# Altium project MainBoard.PrjPcb
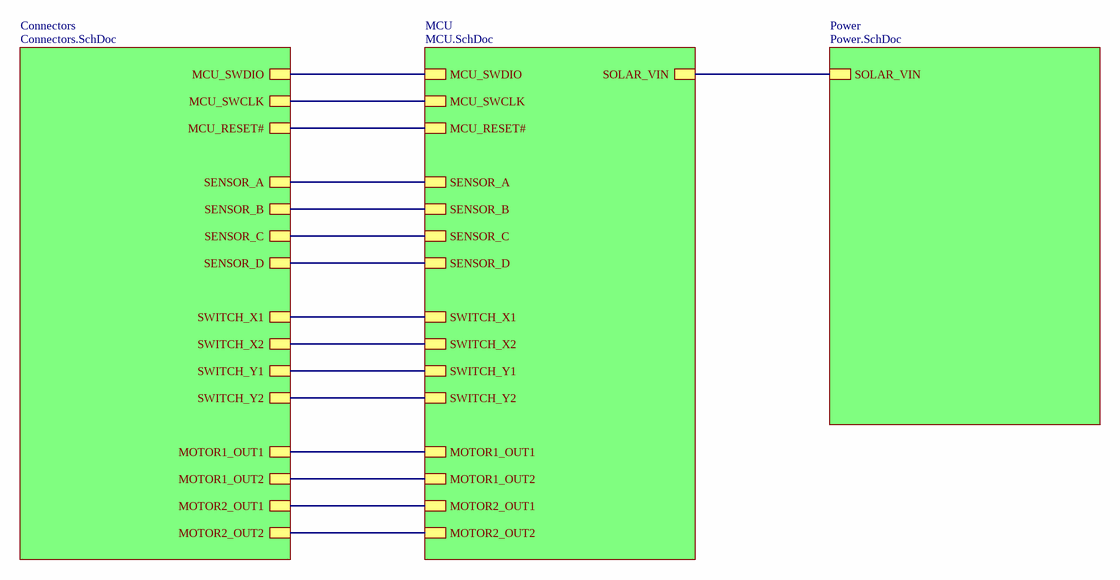
[diagram p0: Main.SchDoc]
ProjectAuthor: NeoProg; ProjectRevision: 1.00; ProjectStatus: D
4 sheets, 74 parts. Net scope: hierarchical (ports join the sheet entries above them; power ports are global).
Board file: PCB.PcbDoc
Sheets:
  Main.SchDoc
    Connectors = Connectors.SchDoc
    MCU = MCU.SchDoc
    Power = Power.SchDoc

## Sheet Main.SchDoc
size A3; SheetNumber: 1; SheetTotal: 1

### Sub-sheets
Connectors = Connectors.SchDoc: MCU_SWDIO, MCU_SWCLK, MCU_RESET#, SENSOR_A, SENSOR_B, SENSOR_C, SENSOR_D, SWITCH_X1, SWITCH_X2, SWITCH_Y1, SWITCH_Y2, MOTOR1_OUT1, MOTOR1_OUT2, MOTOR2_OUT1, MOTOR2_OUT2
MCU = MCU.SchDoc: MCU_SWDIO, MCU_SWCLK, MCU_RESET#, SOLAR_VIN, SENSOR_A, SENSOR_B, SENSOR_C, SENSOR_D, SWITCH_X1, SWITCH_X2, SWITCH_Y1, SWITCH_Y2, MOTOR1_OUT1, MOTOR1_OUT2, MOTOR2_OUT1, MOTOR2_OUT2
Power = Power.SchDoc: SOLAR_VIN

### Nets
MCU_RESET#: sheet Connectors/MCU_RESET#, sheet MCU/MCU_RESET#
MCU_SWCLK: sheet Connectors/MCU_SWCLK, sheet MCU/MCU_SWCLK
MCU_SWDIO: sheet Connectors/MCU_SWDIO, sheet MCU/MCU_SWDIO
MOTOR1_OUT1: sheet Connectors/MOTOR1_OUT1, sheet MCU/MOTOR1_OUT1
MOTOR1_OUT2: sheet Connectors/MOTOR1_OUT2, sheet MCU/MOTOR1_OUT2
MOTOR2_OUT1: sheet Connectors/MOTOR2_OUT1, sheet MCU/MOTOR2_OUT1
MOTOR2_OUT2: sheet Connectors/MOTOR2_OUT2, sheet MCU/MOTOR2_OUT2
SENSOR_A: sheet Connectors/SENSOR_A, sheet MCU/SENSOR_A
SENSOR_B: sheet Connectors/SENSOR_B, sheet MCU/SENSOR_B
SENSOR_C: sheet Connectors/SENSOR_C, sheet MCU/SENSOR_C
SENSOR_D: sheet Connectors/SENSOR_D, sheet MCU/SENSOR_D
SOLAR_VIN: sheet MCU/SOLAR_VIN, sheet Power/SOLAR_VIN
SWITCH_X1: sheet Connectors/SWITCH_X1, sheet MCU/SWITCH_X1
SWITCH_X2: sheet Connectors/SWITCH_X2, sheet MCU/SWITCH_X2
SWITCH_Y1: sheet Connectors/SWITCH_Y1, sheet MCU/SWITCH_Y1
SWITCH_Y2: sheet Connectors/SWITCH_Y2, sheet MCU/SWITCH_Y2

## Sheet Connectors.SchDoc
size A4; SheetNumber: 1; SheetTotal: 1
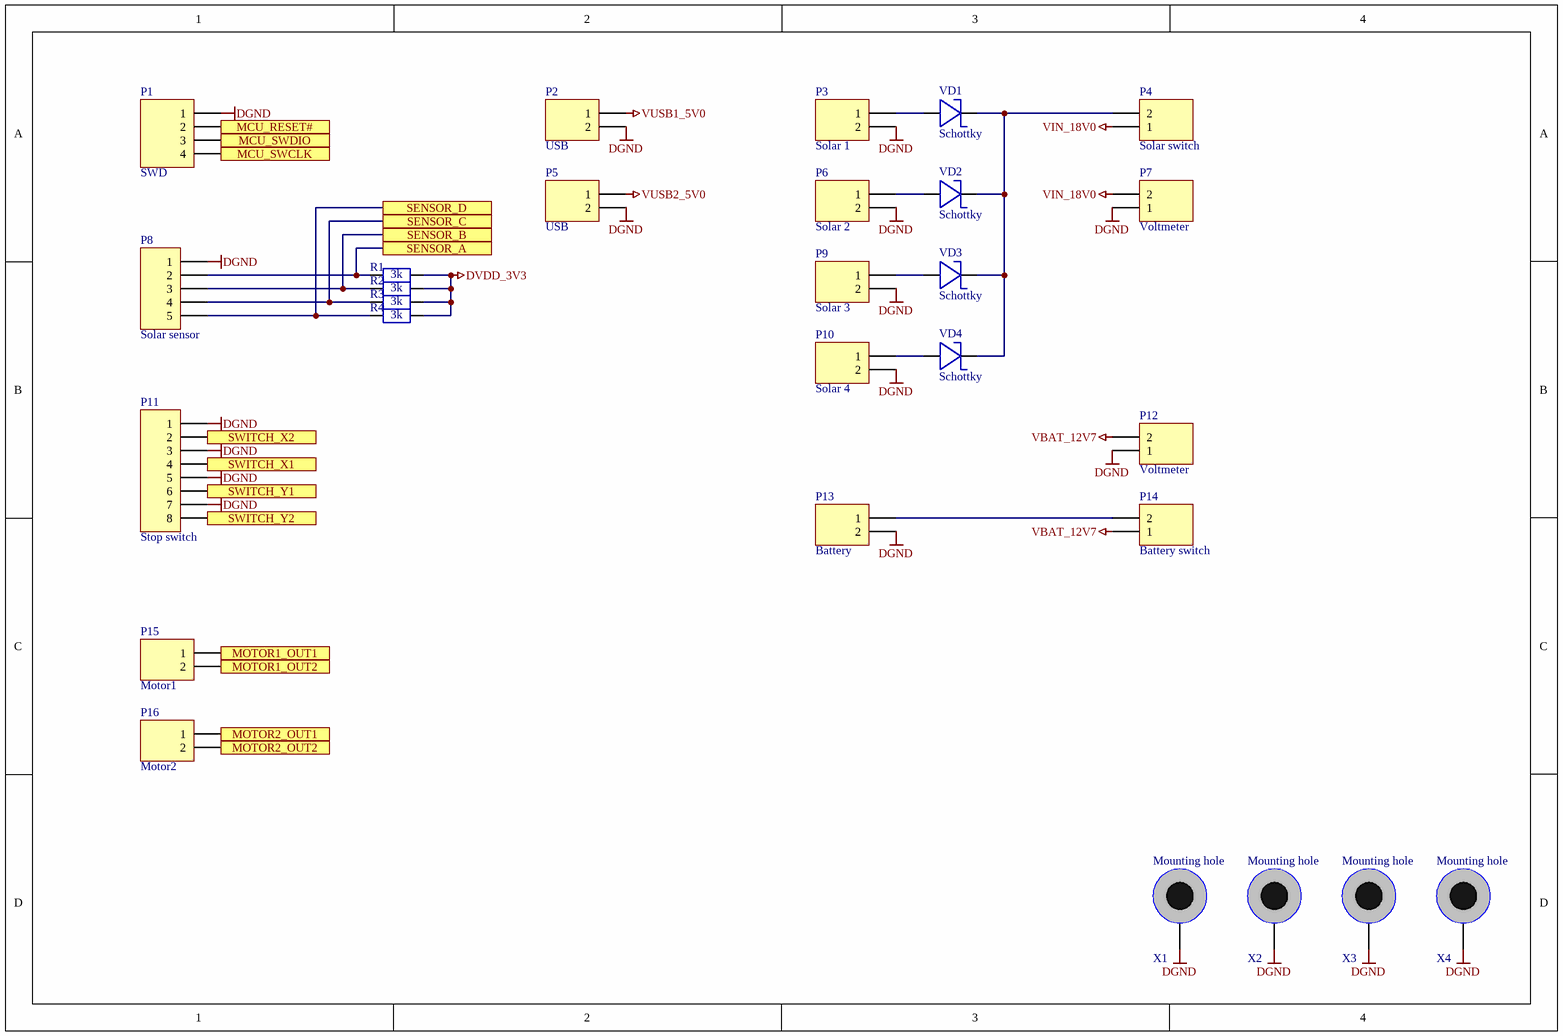
[diagram p1: Connectors.SchDoc]

### Parts
P1  SWD  [PLS-4 2.54]
P2  USB  [CWF-2]
P3  Solar 1  [CWF-2]
P4  Solar switch  [CWF-2]
P5  USB  [CWF-2]
P6  Solar 2  [CWF-2]
P7  Voltmeter  [CWF-2]
P8  Solar sensor  [HDR1X5]
P9  Solar 3  [CWF-2]
P10  Solar 4  [CWF-2]
P11  Stop switch  [HDR1X8]
P12  Voltmeter  [CWF-2]
P13  Battery  [CWF-2]
P14  Battery switch  [CWF-2]
P15  Motor1  [CWF-2]
P16  Motor2  [CWF-2]
R1  3k  [R_0603/1608]
R2  3k  [R_0603/1608]
R3  3k  [R_0603/1608]
R4  3k  [R_0603/1608]
VD1  Schottky  [DO214AC/SMA]
VD2  Schottky  [DO214AC/SMA]
VD3  Schottky  [DO214AC/SMA]
VD4  Schottky  [DO214AC/SMA]
X1  Mounting hole  [HOLE_M3_D6.0/3.5]  (no BOM)
X2  Mounting hole  [HOLE_M3_D6.0/3.5]  (no BOM)
X3  Mounting hole  [HOLE_M3_D6.0/3.5]  (no BOM)
X4  Mounting hole  [HOLE_M3_D6.0/3.5]  (no BOM)

### Ports
MCU_RESET#, MCU_SWCLK, MCU_SWDIO, MOTOR1_OUT1, MOTOR1_OUT2, MOTOR2_OUT1, MOTOR2_OUT2, SENSOR_A, SENSOR_B, SENSOR_C, SENSOR_D, SWITCH_X1, SWITCH_X2, SWITCH_Y1, SWITCH_Y2

### Nets
DGND: P1.1 P2.2 P3.2 P5.2 P6.2 P7.1 P8.1 P9.2 P10.2 P11.1 P11.3 P11.5 P11.7 P12.1 P13.2 X1.1 X2.1 X3.1 X4.1
DVDD_3V3: R1.1 R2.1 R3.1 R4.1
VBAT_12V7: P12.2 P14.1
VIN_18V0: P4.1 P7.2
VUSB1_5V0: P2.1
VUSB2_5V0: P5.1
MCU_RESET#: P1.2 ; port MCU_RESET#
MCU_SWCLK: P1.4 ; port MCU_SWCLK
MCU_SWDIO: P1.3 ; port MCU_SWDIO
MOTOR1_OUT1: P15.1 ; port MOTOR1_OUT1
MOTOR1_OUT2: P15.2 ; port MOTOR1_OUT2
MOTOR2_OUT1: P16.1 ; port MOTOR2_OUT1
MOTOR2_OUT2: P16.2 ; port MOTOR2_OUT2
SENSOR_A: P8.2 R1.2 ; port SENSOR_A
SENSOR_B: P8.3 R2.2 ; port SENSOR_B
SENSOR_C: P8.4 R3.2 ; port SENSOR_C
SENSOR_D: P8.5 R4.2 ; port SENSOR_D
SWITCH_X1: P11.4 ; port SWITCH_X1
SWITCH_X2: P11.2 ; port SWITCH_X2
SWITCH_Y1: P11.6 ; port SWITCH_Y1
SWITCH_Y2: P11.8 ; port SWITCH_Y2
NetP3_1: P3.1 VD1.1
NetP4_2: P4.2 VD1.2 VD2.2 VD3.2 VD4.2
NetP6_1: P6.1 VD2.1
NetP9_1: P9.1 VD3.1
NetP10_1: P10.1 VD4.1
NetP13_1: P13.1 P14.2

### Library data of the parts
P1 = Header 4: Header, 4-Pin; LatestRevisionDate: 17-Jul-2002; LatestRevisionNote: Re-released for DXP Platform.; Publisher: Altium Limited
P2-P7 P9 P10 P12-P16 = Header 2: Header, 2-Pin; LatestRevisionDate: 17-Jul-2002; LatestRevisionNote: Re-released for DXP Platform.; Publisher: Altium Limited
P8 = Header 5: Header, 5-Pin; LatestRevisionDate: 17-Jul-2002; LatestRevisionNote: Re-released for DXP Platform.; Publisher: Altium Limited
P11 = Header 8: Header, 8-Pin; LatestRevisionDate: 17-Jul-2002; LatestRevisionNote: Re-released for DXP Platform.; Publisher: Altium Limited
R1-R4 = Resistor
VD1-VD4 = Schottky: Schottky diode
X1-X4 = Mounting hole: Hole for screw M3, outline D6

## Sheet MCU.SchDoc
size A4; SheetNumber: 1; SheetTotal: 1
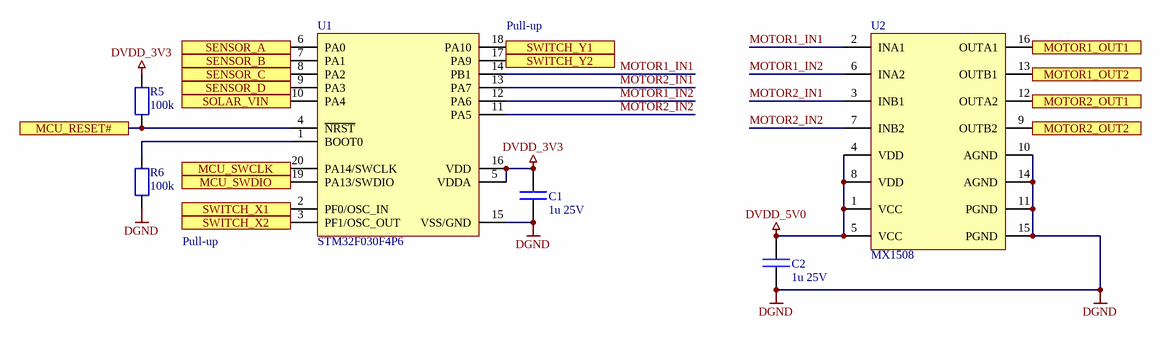
[diagram p2: MCU.SchDoc]

### Parts
C1  1u 25V  [C_0603/1608]
C2  1u 25V  [C_0603/1608]
R5  100k  [R_0603/1608]
R6  100k  [R_0603/1608]
U1  STM32F030F4P6  [SO20_0.65]
U2  MX1508  [SO16_1.27]

### Ports
MCU_RESET#, MCU_SWCLK, MCU_SWDIO, MOTOR1_OUT1, MOTOR1_OUT2, MOTOR2_OUT1, MOTOR2_OUT2, SENSOR_A, SENSOR_B, SENSOR_C, SENSOR_D, SOLAR_VIN, SWITCH_X1, SWITCH_X2, SWITCH_Y1, SWITCH_Y2

### Nets
DGND: C1.2 C2.2 R6.1 U1.15(VSS/GND) U2.10(AGND) U2.11(PGND) U2.14(AGND) U2.15(PGND)
DVDD_3V3: C1.1 R5.1 U1.5(VDDA) U1.16(VDD)
DVDD_5V0: C2.1 U2.1(VCC) U2.4(VDD) U2.5(VCC) U2.8(VDD)
MCU_RESET#: R5.2 U1.4(~{NRST}) ; port MCU_RESET#
MCU_SWCLK: U1.20(PA14/SWCLK) ; port MCU_SWCLK
MCU_SWDIO: U1.19(PA13/SWDIO) ; port MCU_SWDIO
MOTOR1_IN1: U1.14(PB1) U2.2(INA1)
MOTOR1_IN2: U1.12(PA6) U2.6(INA2)
MOTOR1_OUT1: U2.16(OUTA1) ; port MOTOR1_OUT1
MOTOR1_OUT2: U2.13(OUTB1) ; port MOTOR1_OUT2
MOTOR2_IN1: U1.13(PA7) U2.3(INB1)
MOTOR2_IN2: U1.11(PA5) U2.7(INB2)
MOTOR2_OUT1: U2.12(OUTA2) ; port MOTOR2_OUT1
MOTOR2_OUT2: U2.9(OUTB2) ; port MOTOR2_OUT2
SENSOR_A: U1.6(PA0) ; port SENSOR_A
SENSOR_B: U1.7(PA1) ; port SENSOR_B
SENSOR_C: U1.8(PA2) ; port SENSOR_C
SENSOR_D: U1.9(PA3) ; port SENSOR_D
SOLAR_VIN: U1.10(PA4) ; port SOLAR_VIN
SWITCH_X1: U1.2(PF0/OSC_IN) ; port SWITCH_X1
SWITCH_X2: U1.3(PF1/OSC_OUT) ; port SWITCH_X2
SWITCH_Y1: U1.18(PA10) ; port SWITCH_Y1
SWITCH_Y2: U1.17(PA9) ; port SWITCH_Y2
NetR6_2: R6.2 U1.1(BOOT0)

Not connected (* = marked no-connect by the designer): U1 0(EP)

### Notes on the sheet
- (near U1) Pull-up
- Pull-up

### Library data of the parts
C1 C2 = Capacitor: Non-polarized capacitor
R5 R6 = Resistor
U1 = STM32F030F: 32-bit Cortex-M0
U2 = MX1508: Dual DC motor driver

## Sheet Power.SchDoc
size A4; SheetNumber: 1; SheetTotal: 1
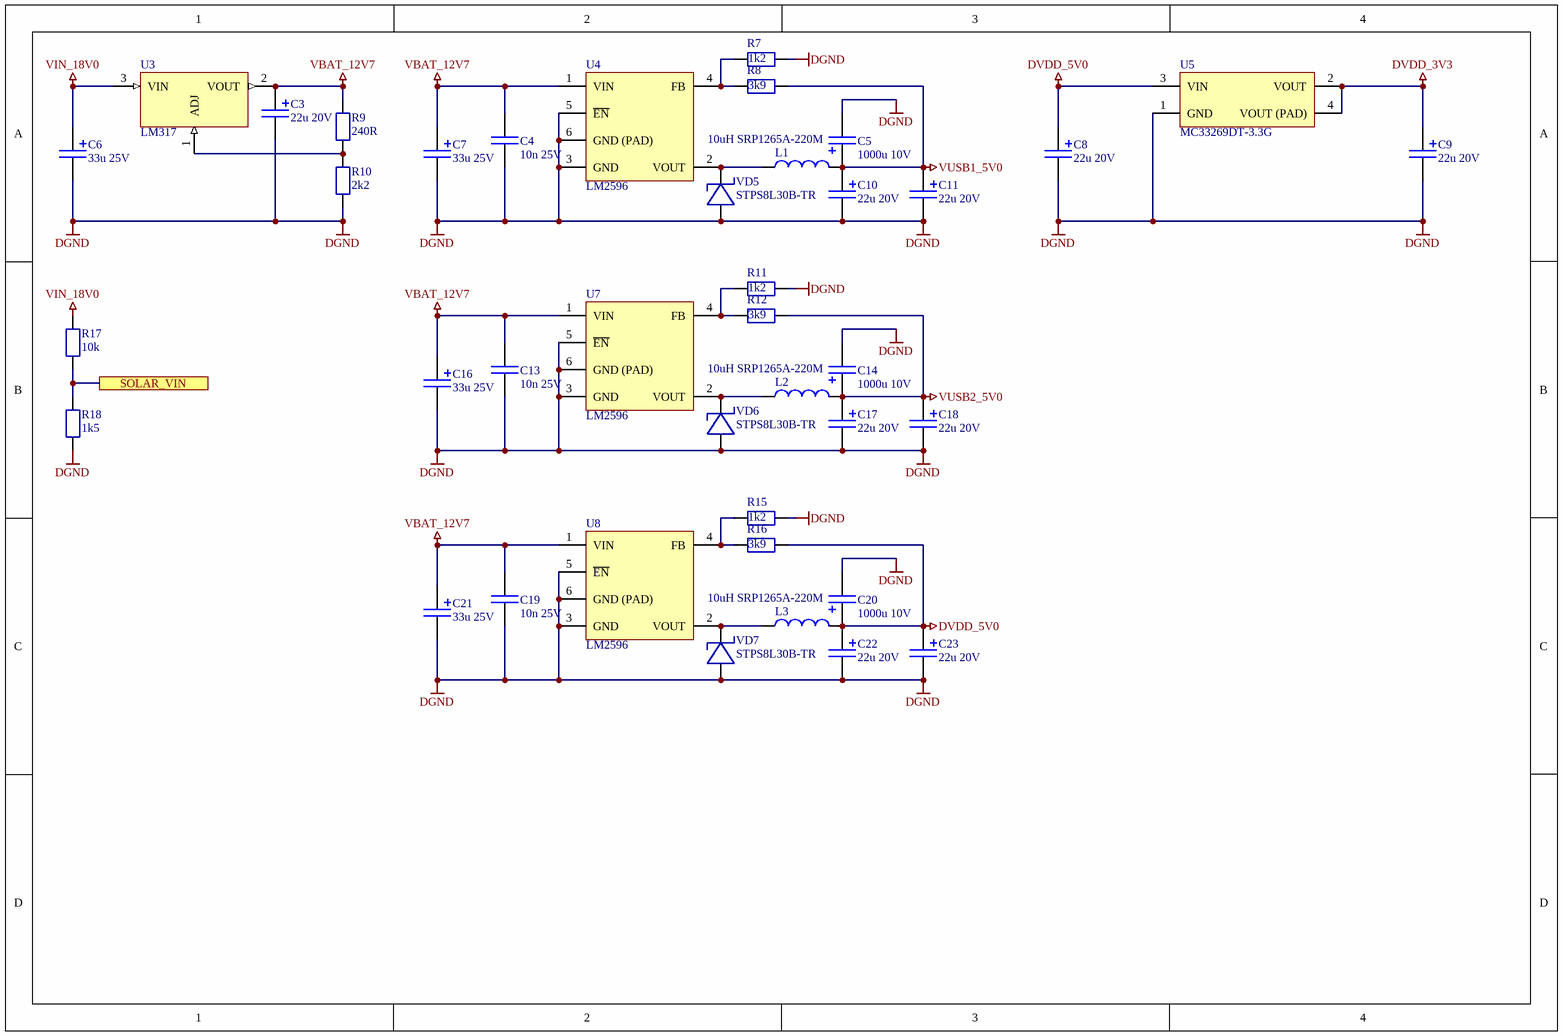
[diagram p3: Power.SchDoc]

### Parts
C3  22u 20V  [TECAP_TYPE_B]
C4  10n 25V  [C_0805/2012]
C5  1000u 10V  [ECAP_D10.0x10.5]
C6  33u 25V  [TECAP_TYPE_B]
C7  33u 25V  [TECAP_TYPE_C]
C8  22u 20V  [TECAP_TYPE_B]
C9  22u 20V  [TECAP_TYPE_B]
C10  22u 20V  [TECAP_TYPE_D]
C11  22u 20V  [TECAP_TYPE_D]
C13  10n 25V  [C_0805/2012]
C14  1000u 10V  [ECAP_D10.0x10.5]
C16  33u 25V  [TECAP_TYPE_C]
C17  22u 20V  [TECAP_TYPE_D]
C18  22u 20V  [TECAP_TYPE_D]
C19  10n 25V  [C_0805/2012]
C20  1000u 10V  [ECAP_D10.0x10.5]
C21  33u 25V  [TECAP_TYPE_C]
C22  22u 20V  [TECAP_TYPE_D]
C23  22u 20V  [TECAP_TYPE_D]
L1  10uH SRP1265A-220M  [L_13x13]
L2  10uH SRP1265A-220M  [L_13x13]
L3  10uH SRP1265A-220M  [L_13x13]
R7  1k2  [R_0805/2012]
R8  3k9  [R_0805/2012]
R9  240R  [R_0603/1608]
R10  2k2  [R_0603/1608]
R11  1k2  [R_0805/2012]
R12  3k9  [R_0805/2012]
R15  1k2  [R_0805/2012]
R16  3k9  [R_0805/2012]
R17  10k  [R_0603/1608]
R18  1k5  [R_0603/1608]
U3  LM317  [TO-220 HOR]
U4  LM2596  [TO263-5/D2PAK-5]
U5  MC33269DT-3.3G  [TO252AA/DPAK]
U7  LM2596  [TO263-5/D2PAK-5]
U8  LM2596  [TO263-5/D2PAK-5]
VD5  STPS8L30B-TR  [TO252AA/DPAK]
VD6  STPS8L30B-TR  [TO252AA/DPAK]
VD7  STPS8L30B-TR  [TO252AA/DPAK]

### Ports
SOLAR_VIN

### Nets
DGND: C3.2(NEG) C4.2 C5.2(NEG) C6.2(NEG) C7.2(NEG) C8.2(NEG) C9.2(NEG) C10.2(NEG) C11.2(NEG) C13.2 C14.2(NEG) C16.2(NEG) C17.2(NEG) C18.2(NEG) C19.2 C20.2(NEG) C21.2(NEG) C22.2(NEG) C23.2(NEG) R7.1 R10.1 R11.1 R15.1 R18.1 U4.3(GND) U4.5(~{EN}) U4.6(GND_(PAD)) U5.1(GND) U7.3(GND) U7.5(~{EN}) U7.6(GND_(PAD)) U8.3(GND) U8.5(~{EN}) U8.6(GND_(PAD)) VD5.1 VD6.1 VD7.1
DVDD_3V3: C9.1(POS) U5.2(VOUT) U5.4(VOUT_(PAD))
DVDD_5V0: C8.1(POS) C20.1(POS) C22.1(POS) C23.1(POS) L3.2 R16.1 U5.3(VIN)
VBAT_12V7: C3.1(POS) C4.1 C7.1(POS) C13.1 C16.1(POS) C19.1 C21.1(POS) R9.2 U3.2(VOUT) U4.1(VIN) U7.1(VIN) U8.1(VIN)
VIN_18V0: C6.1(POS) R17.2 U3.3(VIN)
VUSB1_5V0: C5.1(POS) C10.1(POS) C11.1(POS) L1.2 R8.1
VUSB2_5V0: C14.1(POS) C17.1(POS) C18.1(POS) L2.2 R12.1
SOLAR_VIN: R17.1 R18.2 ; port SOLAR_VIN
NetL1_1: L1.1 U4.2(VOUT) VD5.2
NetL2_1: L2.1 U7.2(VOUT) VD6.2
NetL3_1: L3.1 U8.2(VOUT) VD7.2
NetR7_2: R7.2 R8.2 U4.4(FB)
NetR9_1: R9.1 R10.2 U3.1(ADJ)
NetR11_2: R11.2 R12.2 U7.4(FB)
NetR15_2: R15.2 R16.2 U8.4(FB)

### Library data of the parts
C3 C8-C11 C17 C18 C22 C23 = Capacitor polar: Polarized capacitor / (9000629220)
C4 C13 C19 = Capacitor: Non-polarized capacitor
C5 C14 C20 = Capacitor polar: Polarized capacitor
C6 C7 C16 C21 = Capacitor polar: Polarized capacitor / (9000629234)
L1-L3 = Inductor
R7-R12 R15-R18 = Resistor
U3 = LM317: Linear regulator LM317
U4 U7 U8 = LM2576: DC-DC step-down switching regulator
U5 = LM1117: LDO voltage regulator; pin to pad: 2>3 3>2 4>3
VD5-VD7 = Schottky: Schottky diode; pin to pad: 2>3

## Nets that join several sheets
DGND: Connectors (19 pins), MCU (8 pins), Power (37 pins)
DVDD_3V3: Connectors (R1.1 R2.1 R3.1 R4.1), MCU (C1.1 R5.1 U1.5 U1.16), Power (C9.1 U5.2 U5.4)
DVDD_5V0: MCU (5 pins), Power (7 pins)
VBAT_12V7: Connectors (P12.2 P14.1), Power (12 pins)
VIN_18V0: Connectors (P4.1 P7.2), Power (C6.1 R17.2 U3.3)
VUSB1_5V0: Connectors (P2.1), Power (5 pins)
VUSB2_5V0: Connectors (P5.1), Power (5 pins)
MCU_RESET#: Connectors (P1.2), MCU (R5.2 U1.4)
MCU_SWCLK: Connectors (P1.4), MCU (U1.20)
MCU_SWDIO: Connectors (P1.3), MCU (U1.19)
MOTOR1_OUT1: Connectors (P15.1), MCU (U2.16)
MOTOR1_OUT2: Connectors (P15.2), MCU (U2.13)
MOTOR2_OUT1: Connectors (P16.1), MCU (U2.12)
MOTOR2_OUT2: Connectors (P16.2), MCU (U2.9)
SENSOR_A: Connectors (P8.2 R1.2), MCU (U1.6)
SENSOR_B: Connectors (P8.3 R2.2), MCU (U1.7)
SENSOR_C: Connectors (P8.4 R3.2), MCU (U1.8)
SENSOR_D: Connectors (P8.5 R4.2), MCU (U1.9)
SOLAR_VIN: MCU (U1.10), Power (R17.1 R18.2)
SWITCH_X1: Connectors (P11.4), MCU (U1.2)
SWITCH_X2: Connectors (P11.2), MCU (U1.3)
SWITCH_Y1: Connectors (P11.6), MCU (U1.18)
SWITCH_Y2: Connectors (P11.8), MCU (U1.17)

## Assembly variants
Base: all parts fitted